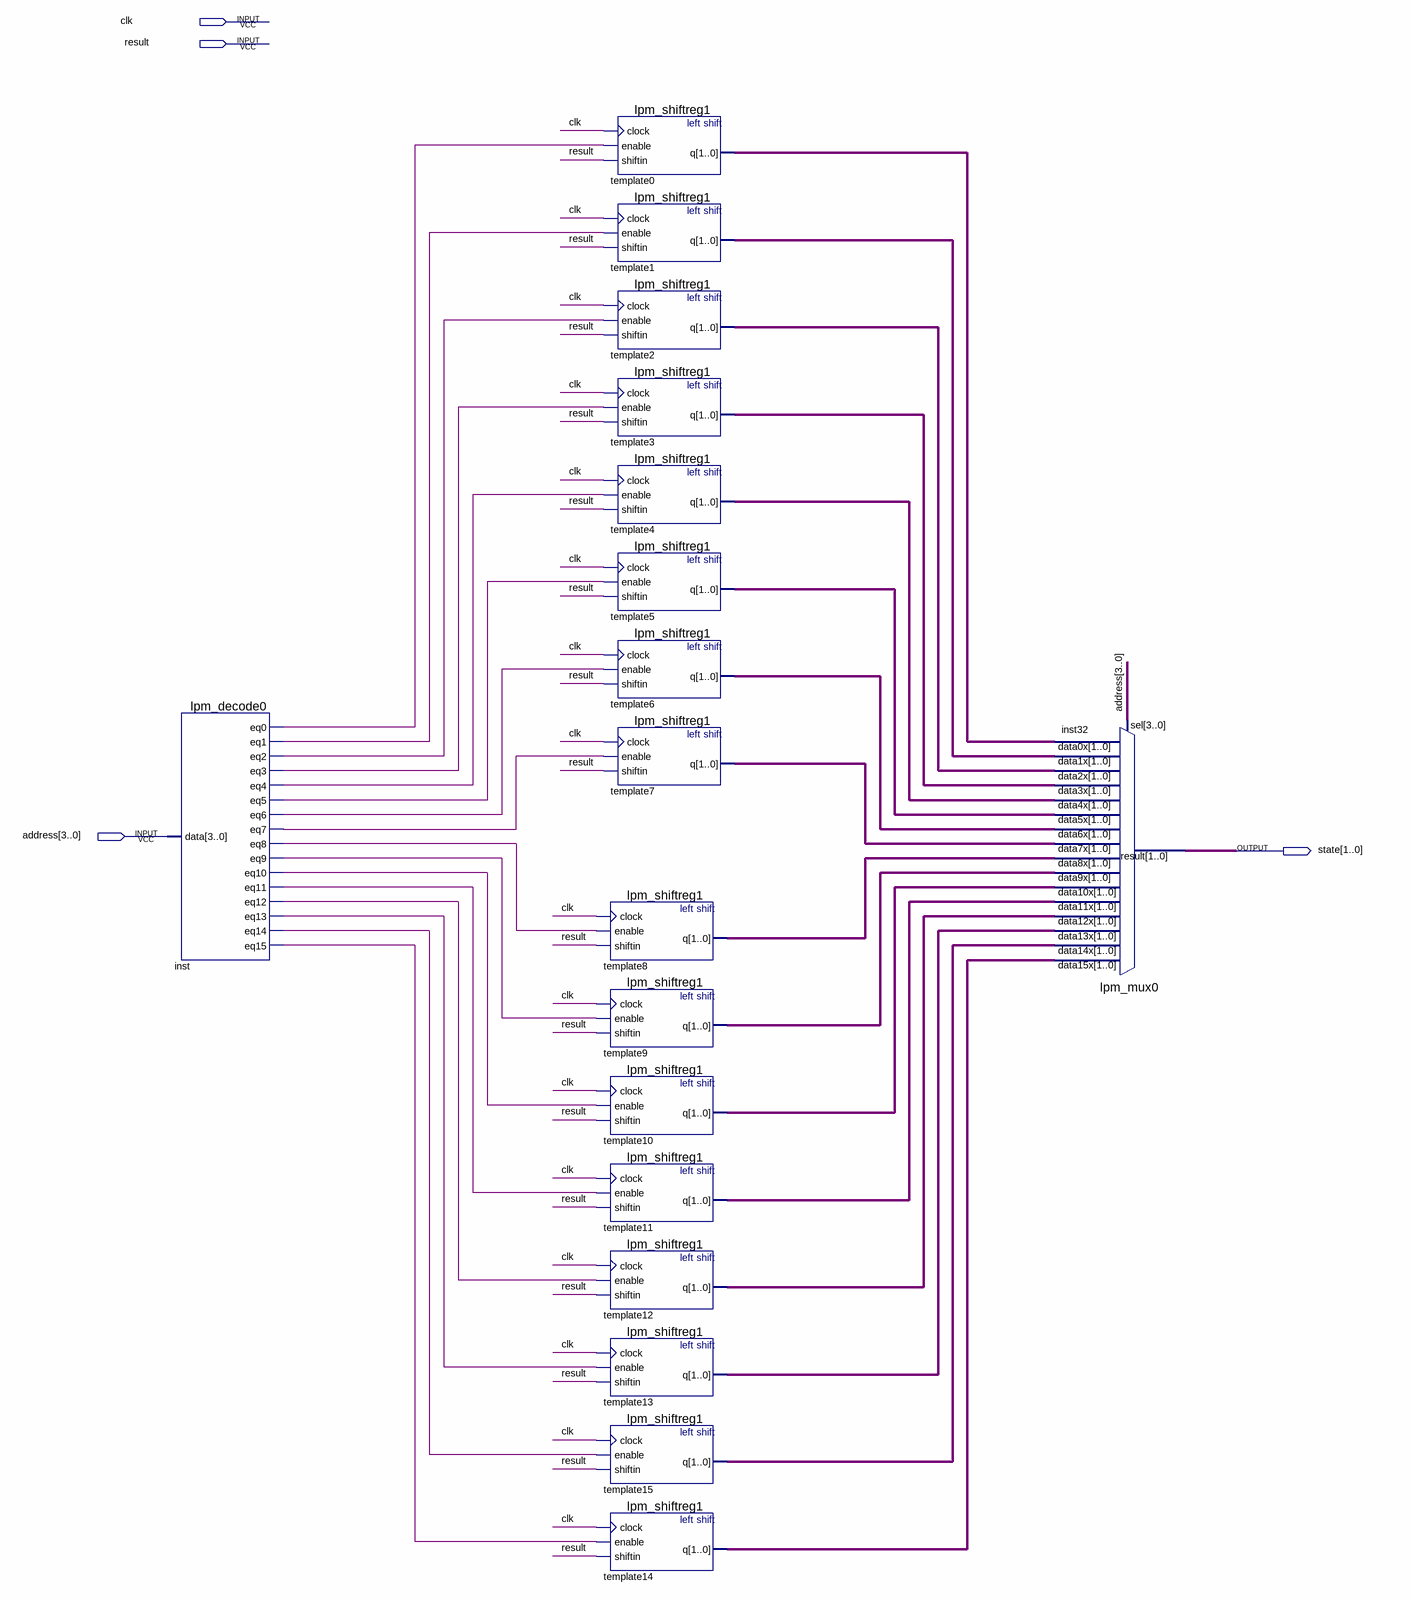
[diagram p0: schematic sheet]
// Quartus schematic PHT.bdf as structural Verilog: 18 symbols, 4 pins
module PHT (
  input  clk,
  input  result,
  input  [3:0] address,
  output [1:0] state
);

  wire inst_eq0, inst_eq1, inst_eq2, inst_eq3, inst_eq4, inst_eq5, inst_eq6, inst_eq7, inst_eq8, inst_eq9,
       inst_eq10, inst_eq11, inst_eq12, inst_eq13, inst_eq14, inst_eq15;
  wire [1:0] template0_q, template1_q, template2_q, template3_q, template4_q, template5_q, template6_q,
       template7_q, template8_q, template9_q, template10_q, template11_q, template12_q, template13_q,
       template14_q, template15_q;

  lpm_decode0 inst (
    .data(address), .eq0(inst_eq0), .eq1(inst_eq1), .eq2(inst_eq2), .eq3(inst_eq3), .eq4(inst_eq4),
    .eq5(inst_eq5), .eq6(inst_eq6), .eq7(inst_eq7), .eq8(inst_eq8), .eq9(inst_eq9), .eq10(inst_eq10),
    .eq11(inst_eq11), .eq12(inst_eq12), .eq13(inst_eq13), .eq14(inst_eq14), .eq15(inst_eq15));
  lpm_shiftreg1 template0 (.clock(clk), .enable(inst_eq0), .shiftin(result), .q(template0_q));
  lpm_shiftreg1 template1 (.clock(clk), .enable(inst_eq1), .shiftin(result), .q(template1_q));
  lpm_shiftreg1 template2 (.clock(clk), .enable(inst_eq2), .shiftin(result), .q(template2_q));
  lpm_shiftreg1 template3 (.clock(clk), .enable(inst_eq3), .shiftin(result), .q(template3_q));
  lpm_shiftreg1 template4 (.clock(clk), .enable(inst_eq4), .shiftin(result), .q(template4_q));
  lpm_shiftreg1 template5 (.clock(clk), .enable(inst_eq5), .shiftin(result), .q(template5_q));
  lpm_shiftreg1 template6 (.clock(clk), .enable(inst_eq6), .shiftin(result), .q(template6_q));
  lpm_shiftreg1 template7 (.clock(clk), .enable(inst_eq7), .shiftin(result), .q(template7_q));
  lpm_shiftreg1 template8 (.clock(clk), .enable(inst_eq8), .shiftin(result), .q(template8_q));
  lpm_shiftreg1 template9 (.clock(clk), .enable(inst_eq9), .shiftin(result), .q(template9_q));
  lpm_shiftreg1 template10 (.clock(clk), .enable(inst_eq10), .shiftin(result), .q(template10_q));
  lpm_shiftreg1 template11 (.clock(clk), .enable(inst_eq11), .shiftin(result), .q(template11_q));
  lpm_shiftreg1 template12 (.clock(clk), .enable(inst_eq12), .shiftin(result), .q(template12_q));
  lpm_shiftreg1 template13 (.clock(clk), .enable(inst_eq13), .shiftin(result), .q(template13_q));
  lpm_shiftreg1 template15 (.clock(clk), .enable(inst_eq14), .shiftin(result), .q(template15_q));
  lpm_shiftreg1 template14 (.clock(clk), .enable(inst_eq15), .shiftin(result), .q(template14_q));
  lpm_mux0 inst32 (
    .data15x(template14_q), .data14x(template15_q), .data13x(template13_q), .data12x(template12_q),
    .data11x(template11_q), .data10x(template10_q), .data9x(template9_q), .data8x(template8_q),
    .data7x(template7_q), .data6x(template6_q), .data5x(template5_q), .data4x(template4_q),
    .data3x(template3_q), .data2x(template2_q), .data1x(template1_q), .data0x(template0_q), .sel(address),
    .result(state));
endmodule
